# EAGLE design tft (EAGLE 6.6.0)
DATABASE: ../partsdb.txt
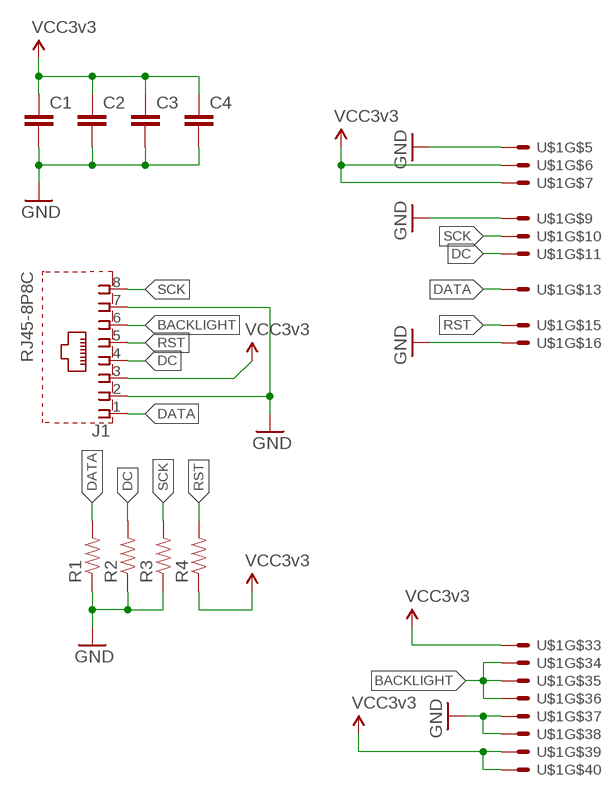
[diagram p0: schematic, sheet 1]

## Parts
C1  CAP1206  [1206]
C2  CAP1206  [1206]
C3  CAP1206  [1206]
C4  CAP1206  [1206]
J1  RJ45-8P8C  [54602-908LF]
R1  RESISTOR0603  [0603-RES]
R2  RESISTOR0603  [0603-RES]
R3  RESISTOR0603  [0603-RES]
R4  RESISTOR0603  [0603-RES]
U$1  XF2M-4015-WONKY  [XF2M-4015-WONKY]

## Nets
BACKLIGHT: J1.6 U$1.34 U$1.35 U$1.36
DATA: J1.1 R1.2 U$1.13
DC: J1.4 R2.2 U$1.11
GND: C1.2 C2.2 C3.2 C4.2 J1.2 J1.7 R1.1 R2.1 R3.1 U$1.5 U$1.9 U$1.16 U$1.37 U$1.38
RST: J1.5 R4.2 U$1.15
SCK: J1.8 R3.2 U$1.10
VCC3V3: C1.1 C2.1 C3.1 C4.1 J1.3 R4.1 U$1.6 U$1.7 U$1.33 U$1.39 U$1.40 ; supply symbol labelled VCC3v3

## Library data of the parts
C1-C4 = SparkFun-Capacitors:CAP: Capacitor Standard 0603 ceramic capacitor, and 0.1" leaded capacitor.
J1 = cape:RJ45-8P8C; PARTNO: 54602-908LF
R1-R4 = SparkFun-Resistors:RESISTOR: Resistor Basic schematic elements and footprints for 0603, 1206, and PTH resistors.
U$1 = cape:XF2M-4015-WONKY

## Board
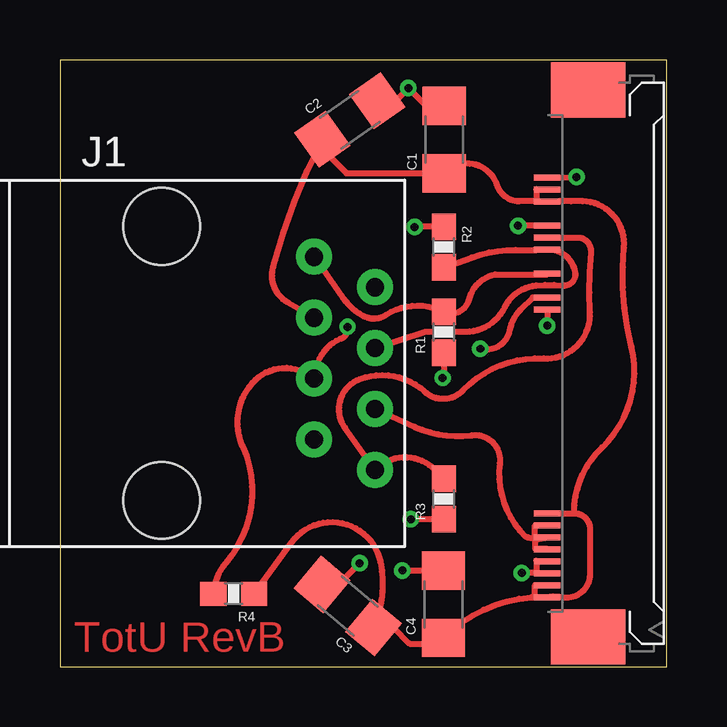
[diagram p1: board, top side]
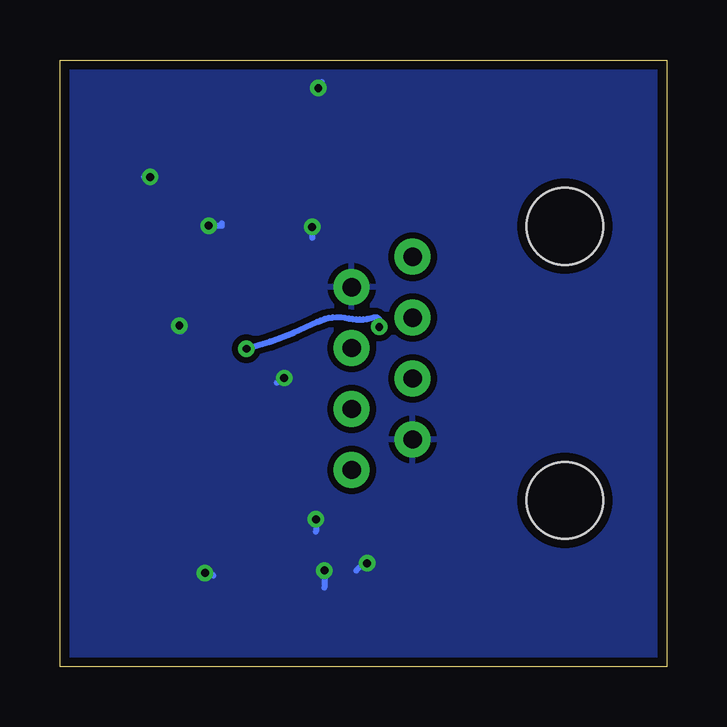
[diagram p2: board, bottom side, seen from below]

Size 25.3 x 25.3 mm. Coordinates in mm from the lower left corner, seen from the top.
Outline: 0,0 25.3,0 25.3,25.3 0,25.3 0,0
Copper layers (1*16): Top 0.0356mm / dielectric 1.5011mm / Bottom 0.0356mm
Design rules "LaenPCBOrder *": minimum track width 6mil, minimum drill 13mil, track to track 6mil, track to pad 6mil, pad to pad 6mil, via to via 6mil, smd to smd 6mil, copper to edge 15mil, drill to drill 6mil, minimum pad ring 7mil, minimum via ring 7mil, stop-mask expansion 3mil, vias tented up to drill 13mil, thermal gap 10mil

### Footprints (pad centres in the part's own frame; a part is rotated, then mirrored left to right if it is on the bottom)
1206 = smd 1.6 x 1.8: 1 -1.4,0; 2 1.4,0
54602-908LF = drill 0.76 pad 1.5: 1 -4.445,6.35; 2 -3.175,8.89; 3 -1.905,6.35; 4 -0.635,8.89; 5 0.635,6.35; 6 1.905,8.89; 7 3.175,6.35; 8 4.445,8.89 | hole 3.2: -5.715,0; 5.715,0
0603-RES = smd 1.1 x 1: 1 -0.85,0; 2 0.85,0
XF2M-4015-WONKY = smd 0.25 x 1.1: 5 -7.75,-2.54; 6 -7.25,-2.54; 7 -6.75,-2.54; 9 -5.75,-2.54; 10 -5.25,-2.54; 11 -4.75,-2.54; 13 -3.75,-2.54; 15 -2.75,-2.54; 16 -2.25,-2.54; 33 6.25,-2.54; 34 6.75,-2.54; 35 7.25,-2.54; 36 7.75,-2.54; 37 8.25,-2.54; 38 8.75,-2.54; 39 9.25,-2.54; 40 9.75,-2.54 | smd 2.3 x 3.1: M1 11.4,-0.84; M2 -11.4,-0.84

### Placement (x,y rotation side)
C1  16.02,21.98 90 top
C2  12.09,22.8 35 top
C3  12,2.54 140 top
C4  15.98,2.61 90 top
J1  4.25,12.65 270 top
R1  16,13.95 90 top
R2  16,17.5 270 top
R3  16,7 90 top
R4  7.24,3.05 180 top
U$1  22.86,12.65 270 top

### Tracks (layer width: path | path; a pad name or v marks a point on that pad's centre or on a via)
BACKLIGHT
  Top 0.254: 19.81,5.38 19.83,5.4 U$1.35 arc-39 19.41,5.44 arc-53 18.34,8.48 arc104 17.17,9.65 arc-31 14.78,10.01 J1.6 | 19.81,5.38 19.81,5.84 | 19.81,5.84 19.81,5.89 | 19.81,5.38 19.81,4.93 20.29,4.93 U$1.36 | U$1.34 19.81,5.84
DATA
  Top 0.254: J1.1 11.79,15.39 arc27 12.65,14.63 arc62 13.61,14.68 arc-60 R1.2 arc101 17.07,15.34 arc-63 18.14,16.36 20.32,16.36 U$1.13
DC
  Top 0.254: J1.4 15.24,13.97 16.92,13.97 arc64 18.54,14.99 arc-59 19.86,15.9 arc-11 20.98,15.9 arc106 21.49,16.46 arc81 U$1.11 arc-4 19,17.37 arc20 17.17,17.07 R2.2
GND  (via drill 0.33)
  Top 0.254: R1.1 16,12.09 v15.95,12.04 | U$1.16 v20.32,14.22 | U$1.5 v21.54,20.42 | R3.1 v14.63,6.15 | C4.2 v14.28,4 v14.28,4.01 | C3.2 11.61,3.44 v12.5,4.32 | U$1.38 19.81,3.91 | 19.81,3.91 v19.25,3.91 | U$1.37 19.86,4.42 19.86,3.96 19.81,3.91 | R2.1 14.79,18.35 v14.78,18.34 | C1.2 15.28,23.38 v14.53,24.13 14,23.6 C2.2 | U$1.9 v19.1,18.4 v19.1,18.39
  Bottom 0.254: v15.95,12.04 16.05,12.04 16.26,11.84 | v20.32,14.22 arc-23 20.27,13.97 | v21.54,20.42 arc-2 21.79,20.42 | v14.63,6.15 14.63,5.64 | v14.28,4.01 14.28,3.3 | v12.5,4.32 12.65,4.32 12.95,4.01 | v19.25,3.91 arc33 18.9,3.81 | v14.78,18.34 14.78,17.88 | v14.53,24.13 14.53,24.23 14.38,24.38 | v19.1,18.39 18.54,18.39 18.54,18.49
  pour Bottom (isolate 0.254): 0,28.14 25,28.14 25,0 0,0
RST  (via drill 0.33)
  Top 0.254: U$1.15 19.72,15.4 19.2,14.88 arc34 18.75,14.02 arc-94 v17.53,13.26 | v11.99,14.17 arc-84 11.68,13.66 arc63 J1.5 arc90 8.03,11.84 arc65 7.62,9.2 arc-64 6.91,4.32 arc37 R4.2
  Bottom 0.254: v17.53,13.26 arc-11 14.58,14.38 arc40 13.26,14.53 arc-32 12.19,14.58 arc127 v11.99,14.17
SCK
  Top 0.254: R3.2 15.64,8.21 arc90 J1.8 11.89,9.96 arc-104 12.5,11.99 arc-64 15.19,11.48 arc89 16.82,11.53 arc-49 20.17,12.85 arc96 22.1,14.78 arc-8 22.15,17.27 arc85 21.69,17.88 20.32,17.88 U$1.10
VCC3V3
  Top 0.254: U$1.6 19.86,19.91 19.86,19.41 | 19.86,19.41 19.86,19.4 U$1.7 arc-2 21.79,19.41 arc-94 23.52,17.48 arc19 23.82,13.36 arc-60 22.61,9.14 arc46 21.44,6.4 | 19.86,19.41 19.15,19.41 arc-72 18.24,20.07 arc117 C1.1 | 19.81,2.9 19.66,2.9 arc41 C4.1 15.74,0.96 14.58,0.96 13.91,1.64 C3.1 arc35 13.36,4.37 arc132 9.65,5.18 R4.1 | 19.81,2.9 19.81,3.4 U$1.39 | 19.81,2.9 U$1.40 arc-21 20.93,2.9 arc101 22.1,3.86 arc0 22.1,5.74 arc90 21.44,6.4 | 21.44,6.4 U$1.33 21.44,6.4 | C1.1 11.94,20.57 10.94,21.57 C2.1 arc12 8.89,16.66 arc75 9.5,15.19 J1.3 | 16.48,21.03 C1.1

### Text on the board
Top: TotU RevB
tStop: TotU RevB